# Altium schematic sheet power_supply.SchDoc
size A
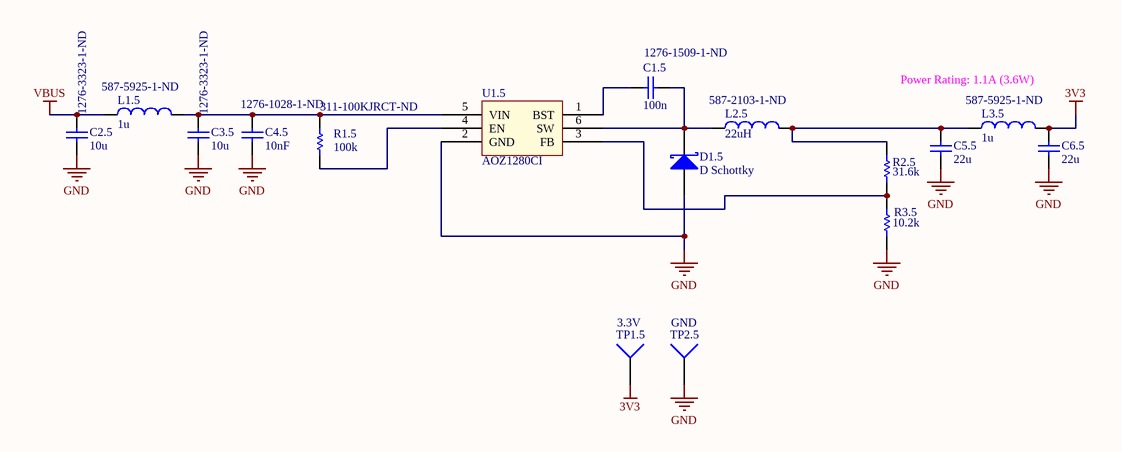
[diagram p0: power_supply.SchDoc]

## Parts
C1.5  Supplier Part Number 1: 1276-1509-1-ND  [0402]  (hidden comment: 100n)
C2.5  Supplier Part Number 1: 1276-3323-1-ND  [1210]  (hidden comment: 10u)
C3.5  Supplier Part Number 1: 1276-3323-1-ND  [1210]  (hidden comment: 10u)
C4.5  Supplier Part Number 1: 1276-1028-1-ND  [0402]  (hidden comment: 10nF)
C5.5  22u  [0805]
C6.5  22u  [0805]
D1.5  D Schottky  [DO-214AC]
L1.5  Supplier Part Number 1: 587-5925-1-ND  [0806]  (hidden comment: 1u)
L2.5  value 22uH  Supplier Part Number 1: 587-2103-1-ND  [Murata 2900]  (hidden comment: 33u)
L3.5  Supplier Part Number 1: 587-5925-1-ND  [0806]  (hidden comment: 1u)
R1.5  Supplier Part Number 1: 311-100KJRCT-ND  [0402]  (hidden comment: 100k)
R2.5  value 31.6k  [0402]  (hidden comment: 9.09k)
R3.5  value 10.2k  [0402]  (hidden comment: 9.09k)
TP1.5  3.3V  [Test Point Target 1mm]  (no BOM)
TP2.5  GND  [Test Point Target 1mm]  (no BOM)
U1.5  Manufacturer Part Number: AOZ1280CI  [MK06A_N]

## Nets
3V3: C6.5.2 L3.5.2 TP1.5.1
GND: C2.5.1 C3.5.1 C4.5.1 C5.5.1 C6.5.1 D1.5.A R3.5.1 TP2.5.1 U1.5.2(GND)
VBUS: C2.5.2 L1.5.1
NetC1.5_1: C1.5.1 U1.5.1(BST)
NetC1.5_2: C1.5.2 D1.5.K L2.5.1 U1.5.6(SW)
NetC3.5_2: C3.5.2 C4.5.2 L1.5.2 R1.5.2 U1.5.5(VIN)
NetC5.5_2: C5.5.2 L2.5.2 L3.5.1 R2.5.2
NetR1.5_1: R1.5.1 U1.5.4(EN)
NetR2.5_1: R2.5.1 R3.5.2 U1.5.3(FB)

## Notes on the sheet
- Power Rating: 1.1A (3.6W)

## Library data of the parts
C1.5 C4.5 = CAPACITOR NON_POL: Supplier 1: Digi-Key
  C1.5: Value: 100n
  C4.5: Value: 10nF
C2.5 C3.5 = CAPACITOR NON_POL: Material: Ceramic; Capacitance: 10uF; Tolerance: 10%; Dielectric: X7R; Voltage Rating: 35V; Value: 10u; ComponentLink1URL: http://www.murata.com/~/media/webrenewal/support/library/catalog/products/capacitor/mlcc/c02e.ashx; ComponentLink1Description: http://www.murata.com/~/media/webrenewal/support/library/catalog/products/capacitor/mlcc/c02e.ashx; Supplier 1: Digi-Key; Stock 1: 421732; Pricing 1: 1 = 0.81000, 10 = 0.57000, 100 = 0.37510, 500 = 0.27788, 1000 = 0.23619 (USD); RoHS: Yes; Mount: Surface Mount; Case/Package: 1210; Case Code (Metric): 3225; Case Code (Imperial): 1210; Min Operating Temperature: -55°C; Max Operating Temperature: 125°C; Package Quantity: 1; Packaging: Tape and Reel; Voltage: 35V; Length: 3.2mm; Height: 1.8mm; Depth: 2.5mm; Width: 0.098inch; Thickness: 0.079inch; Radiation Hardening: No; Lead Free: Lead Free; ComponentLink2URL: https://datasheet.ciiva.com/25724/cl32b106klulnne-25724000.pdf?src-supplier=Digi-Key; ComponentLink2Description: https://datasheet.ciiva.com/25724/cl32b106klulnne-25724000.pdf?src-supplier=Digi-Key; ComponentLink3URL: https://datasheet.ciiva.com/15196/getdatasheetpartid-353216-15196149.pdf?src-supplier=Verical; ComponentLink3Description: https://datasheet.ciiva.com/15196/getdatasheetpartid-353216-15196149.pdf?src-supplier=Verical; ComponentLink4URL: https://datasheet.ciiva.com/29202/450840-da-01-en-vs-kondensator-1210-29202828.pdf?src-supplier=Conrad; ComponentLink4Description: https://datasheet.ciiva.com/29202/450840-da-01-en-vs-kondensator-1210-29202828.pdf?src-supplier=Conrad
C5.5 C6.5 = CAPACITOR NON_POL: Manufacturer: Murata Electronics North America; Manufacturer Part Number: GRM21BR61A226ME44L; Capacitance: 22µF; Tolerance: ±20%; Voltage - Rated: 10V; Temperature Coefficient: X5R; Value: 22u; Supplier 1: Digi-Key; Supplier Part Number 1: 490-10746-1-ND; RoHS: RoHS Compliant; Category: Capacitors; Stock 1: 23435; Pricing 1: 1=0.48, 10=0.34, 100=0.2237, 1000=0.14082 (USD); Packaging: Cut Tape (CT); Part Status: Active; Operating Temperature: -55°C ~ 85°C; Features: -; Ratings: -; Applications: General Purpose; Mounting Type: Surface Mount, MLCC; Package / Case: 0805 (2012 Metric); Size / Dimension: 0.079" L x 0.049" W (2.00mm x 1.25mm); Height - Seated (Max): -; Thickness (Max): 0.057" (1.45mm); Lead Spacing: -; Lead Style: -; ComponentLink1URL: http://www.murata.com/~/media/webrenewal/support/library/catalog/products/capacitor/mlcc/c02e.ashx; ComponentLink1Description: http://www.murata.com/~/media/webrenewal/support/library/catalog/products/capacitor/mlcc/c02e.ashx
D1.5 = D Schottky: Schottky Diode; Manufacturer: Diodes Incorporated; Manufacturer Part Number: B240A-13-F; Current - Average Rectified (Io): 2A; Speed: Fast Recovery =< 500ns, > 200mA (Io); Capacitance @ Vr, F: 200pF @ 4V, 1MHz; Supplier 1: Digi-Key; Supplier Part Number 1: B240A-FDICT-ND; RoHS: RoHS Compliant; Category: Discrete Semiconductor Products; Stock 1: 244420; Pricing 1: 1=0.5, 10=0.38, 100=0.2368, 500=0.16202, 1000=0.12463 (USD); Packaging: Cut Tape (CT); Part Status: Active; Diode Type: Schottky; Mounting Type: Surface Mount; Package / Case: DO-214AC, SMA; Supplier Device Package: SMA; Operating Temperature - Junction: -65°C ~ 150°C; Base Part Number: B240; ComponentLink1URL: https://www.diodes.com/assets/Datasheets/ds13004.pdf; ComponentLink1Description: https://www.diodes.com/assets/Datasheets/ds13004.pdf
L1.5 L3.5 = Inductor: Manufacturer: Taiyo Yuden; Manufacturer Part Number: MAKK2016T1R0M; Type: Wirewound; Material - Core: Metal; Tolerance: ±20%; Current - Saturation: 2.2A; Shielding: Shielded; DC Resistance (DCR): 75 mOhm Max; Value: 1u; Supplier 1: Digi-Key; RoHS: RoHS Compliant; Category: Inductors, Coils, Chokes; Stock 1: 39611; Pricing 1: 1=0.23, 10=0.204, 100=0.1404, 500=0.12, 1000=0.09191 (USD); Packaging: Cut Tape (CT); Part Status: Active; Q @ Freq: -; Frequency - Self Resonant: -; Ratings: -; Operating Temperature: -40°C ~ 105°C; Mounting Type: Surface Mount; Package / Case: 0806 (2016 Metric); Supplier Device Package: 0806 (2016 Metric); Size / Dimension: 0.079" L x 0.063" W (2.00mm x 1.60mm); Height - Seated (Max): 0.039" (1.00mm); ComponentLink1URL: http://ds.yuden.co.jp/TYCOMPAS/ut/detail.do?productNo=MAKK2016T1R0M&fileName=MAKK2016T1R0M_SS&mode=specSheetDownload; ComponentLink1Description: http://ds.yuden.co.jp/TYCOMPAS/ut/detail.do?productNo=MAKK2016T1R0M&fileName=MAKK2016T1R0M_SS&mode=specSheetDownload
L2.5 = Inductor: Manufacturer: Murata Power Solutions Inc; Manufacturer Part Number: 29L104C; Code_IEC: 1005; Inductance: 100µH; Current: 480mA; Shielding: Shielded; DC Resistance (DCR): 456.0 mOhm Max; Frequency - Test: 10kHz; Current - Saturation: 1.1A; Current - Temperature Rise: 1.3A; Frequency - Self Resonant: 11MHz; Published: 8-Jun-2000; LatestRevisionDate: 29-May-2009; LatestRevisionNote: IPC-7351 Footprint Added.; PackageReference: 0402-A; Publisher: Altium Limited; PackageDescription: Chip Inductor; Code_JEITA: 0402; RoHS: RoHS Compliant; Category: Inductors, Coils, Chokes; Current Rating - Saturation: -; Current Rating - Temperature Rise: -; Type: -; Tolerance: -; Q @ Freq: -; Self Resonant Freq: -; Package / Case: 0.283" L x 0.283" W x 0.124" H (7.20mm x 7.20mm x 3.15mm); Mounting Type: Surface Mount; Packaging: Digi-Reel®; Operating Temperature: -40°C ~ 85°C; Core Material: -; Applications: EMI Filter; ComponentLink1URL: http://www.murata-ps.com/data/magnetics/kmp_2900l.pdf; ComponentLink1Description: http://www.murata-ps.com/data/magnetics/kmp_2900l.pdf; Material - Core: -; ComponentLink2URL: http://www.yuden.co.jp/ut/product/pdf/wound_i_all_e.pdf; ComponentLink2Description: http://www.yuden.co.jp/ut/product/pdf/wound_i_all_e.pdf; Supplier 1: Digi-Key; Stock 1: 12480; Pricing 1: 1=0.34, 10=0.316, 50=0.2962, 100=0.2765, 500=0.21726, 1000=0.17775, 2000=0.1185, 4000=0.11455, 6000=0.1106, 8000=0.10665, 10000=0.10152, 12000=0.09638 (USD); ComponentLink3URL: http://www.yuden.co.jp/cs/release/pdf/pdf_480.pdf; ComponentLink3Description: http://www.yuden.co.jp/cs/release/pdf/pdf_480.pdf
R1.5 = ERJ2GE: Value: 100k; Supplier 1: Digi-Key
R2.5 = ERJ2GE: Resistor; Manufacturer: Susumu; Manufacturer Part Number: RR0510P-3322-D; Note: If flow soldering, adjust pad width of PCB Footprint to 0.7 - 0.8 times the width of the resistor.; Resistance (Ohms): 33.2K; Power (Watts): 0.063W, 1/16W; Temperature Coefficient: ±25ppm/°C; Tolerance: ±0.5%; Published: 17-Dec-2003; LatestRevisionDate: 19-Mar-2004; LatestRevisionNote: Silkscreen size reduced.; PackageDocument: Mar-2003; PackageReference: 2-0402; Publisher: Altium Limited; Code_IPC: 1005 [0402]; ComponentLink1Description: Manufacturer Link; ComponentLink1URL: http://www.panasonic.com/industrial/components/resistive_products.htm; ComponentLink2Description: Datasheet; ComponentLink2URL: http://www.panasonic.com/industrial/components/pdf/AOA0000CE1.pdf; RoHS: RoHS Compliant; Composition: Thin Film; Features: -; Size / Dimension: 0.039" L x 0.020" W (1.00mm x 0.50mm); Height: 0.016" (0.40mm); Number of Terminations: 2; Packaging: Cut Tape (CT); Package / Case: 0402 (1005 Metric); ComponentLink3URL: http://www.susumu-usa.com/pdf/products_12.pdf; ComponentLink3Description: http://www.susumu-usa.com/pdf/products_12.pdf; Supplier 1: Digi-Key; Supplier Part Number 1: RMCF0402FT31K6CT-ND; Stock 1: 54086; Pricing 1: 1=0.04, 10=0.025, 50=0.0138, 100=0.0105, 250=0.0078, 500=0.00576, 1000=0.00384 (USD); ComponentLink4URL: http://www.seielect.com/Catalog/SEI-RMCF.pdf; ComponentLink4Description: http://www.seielect.com/Catalog/SEI-RMCF.pdf
R3.5 = ERJ2GE: Resistor; Manufacturer: Stackpole Electronics Inc; Manufacturer Part Number: RMCF0402FT14K3; Note: If flow soldering, adjust pad width of PCB Footprint to 0.7 - 0.8 times the width of the resistor.; Resistance (Ohms): 14.3K; Power (Watts): 0.063W, 1/16W; Temperature Coefficient: ±100ppm/°C; Tolerance: ±1%; Published: 17-Dec-2003; LatestRevisionDate: 19-Mar-2004; LatestRevisionNote: Silkscreen size reduced.; PackageDocument: Mar-2003; PackageReference: 2-0402; Publisher: Altium Limited; Code_IPC: 1005 [0402]; ComponentLink1Description: Manufacturer Link; ComponentLink1URL: http://www.panasonic.com/industrial/components/resistive_products.htm; ComponentLink2Description: Datasheet; ComponentLink2URL: http://www.panasonic.com/industrial/components/pdf/AOA0000CE1.pdf; RoHS: RoHS Compliant; Composition: Thick Film; Features: -; Size / Dimension: 0.039" L x 0.020" W (1.00mm x 0.50mm); Height: 0.016" (0.40mm); Number of Terminations: 2; Packaging: Cut Tape (CT); Package / Case: 0402 (1005 Metric); ComponentLink3URL: http://www.seielect.com/Catalog/SEI-RMCF.pdf; ComponentLink3Description: http://www.seielect.com/Catalog/SEI-RMCF.pdf; Supplier 1: Digi-Key; Supplier Part Number 1: RMCF0402FT10K2CT-ND; Stock 1: 8430; Pricing 1: 1=0.04, 10=0.025, 50=0.0138, 100=0.0105, 250=0.0078, 500=0.00576, 1000=0.00384 (USD)
TP1.5 TP2.5 = Socket: LatestRevisionDate: 17-Jul-2002; LatestRevisionNote: Re-released for DXP Platform.; Publisher: Altium Limited
U1.5 = ADP2300: IC BUCK ADJ 1.2A 6TSOT; Manufacturer: Alpha & Omega Semiconductor Inc.; Function: Step-Down; Output Configuration: Positive; Output Type: Adjustable; Number of Outputs: 1; Voltage - Input (Min): 3V; Voltage - Input (Max): 26V; Voltage - Output (Min/Fixed): 0.8V; Frequency - Switching: 1.5MHz; Synchronous Rectifier: No; Supplier 1: Digi-Key; Supplier Part Number 1: 785-1277-1-ND; RoHS: RoHS Compliant; Category: Integrated Circuits (ICs); Stock 1: 404776; Pricing 1: 1=0.7, 10=0.613, 25=0.5428, 100=0.4728, 250=0.41148, 500=0.3502, 1000=0.28016 (USD); Packaging: Cut Tape (CT); Part Status: Active; Topology: Buck; Voltage - Output (Max): 26V; Current - Output: 1.2A; Operating Temperature: -40°C ~ 85°C (TA); Mounting Type: Surface Mount; Package / Case: SOT-23-6; Supplier Device Package: SOT-23-6; ComponentLink1URL: http://aosmd.com/res/data_sheets/AOZ1280CI.pdf; ComponentLink1Description: http://aosmd.com/res/data_sheets/AOZ1280CI.pdf